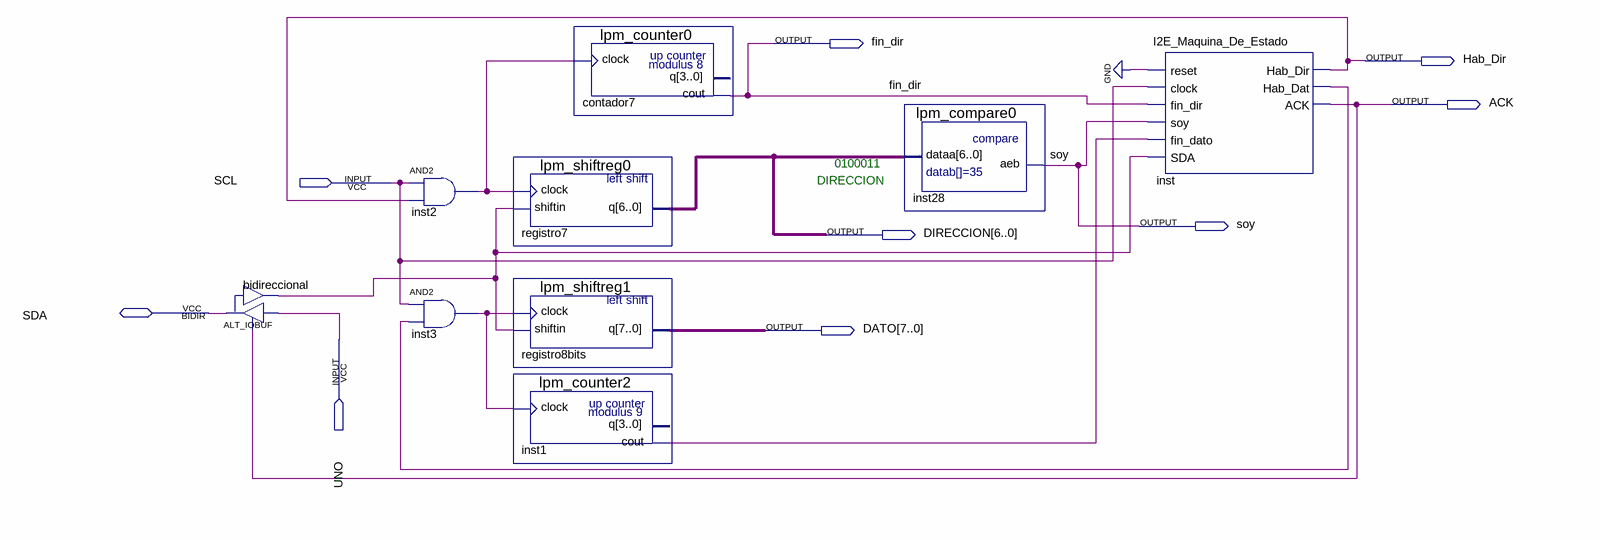
[diagram p0: schematic sheet]
// Quartus schematic I2E_completo.bdf as structural Verilog: 9 symbols, 9 pins
module I2E_completo (
  input  SCL,
  input  UNO,
  inout  SDA,
  output fin_dir,
  output Hab_Dir,
  output ACK,
  output soy,
  output [6:0] DIRECCION,
  output [7:0] DATO
);

  wire bidireccional_o, inst1_cout, inst2_out, inst3_out, inst_hab_dat;

  ALT_IOBUF bidireccional (.i(UNO), .oe(ACK), .o(bidireccional_o), .io(SDA));
  and inst2 (inst2_out, SCL, Hab_Dir);
  and inst3 (inst3_out, SCL, inst_hab_dat);
  lpm_shiftreg0 registro7 (.clock(inst2_out), .shiftin(bidireccional_o), .q(DIRECCION));
  lpm_shiftreg1 registro8bits (.clock(inst3_out), .shiftin(bidireccional_o), .q(DATO));
  lpm_counter2 inst1 (.clock(inst3_out), .cout(inst1_cout));  // open: q
  lpm_counter0 contador7 (.clock(inst2_out), .cout(fin_dir));  // open: q
  lpm_compare0 inst28 (.dataa(DIRECCION), .aeb(soy));
  I2E_Maquina_De_Estado inst (
    .reset(1'b0), .clock(SCL), .fin_dir(fin_dir), .soy(soy), .fin_dato(inst1_cout), .SDA(bidireccional_o),
    .Hab_Dir(Hab_Dir), .Hab_Dat(inst_hab_dat), .ACK(ACK));

  // Notes on the sheet:
  //   0100011
  //   DIRECCION   
endmodule
